# EAGLE design therm-coast (EAGLE 7.7.0)
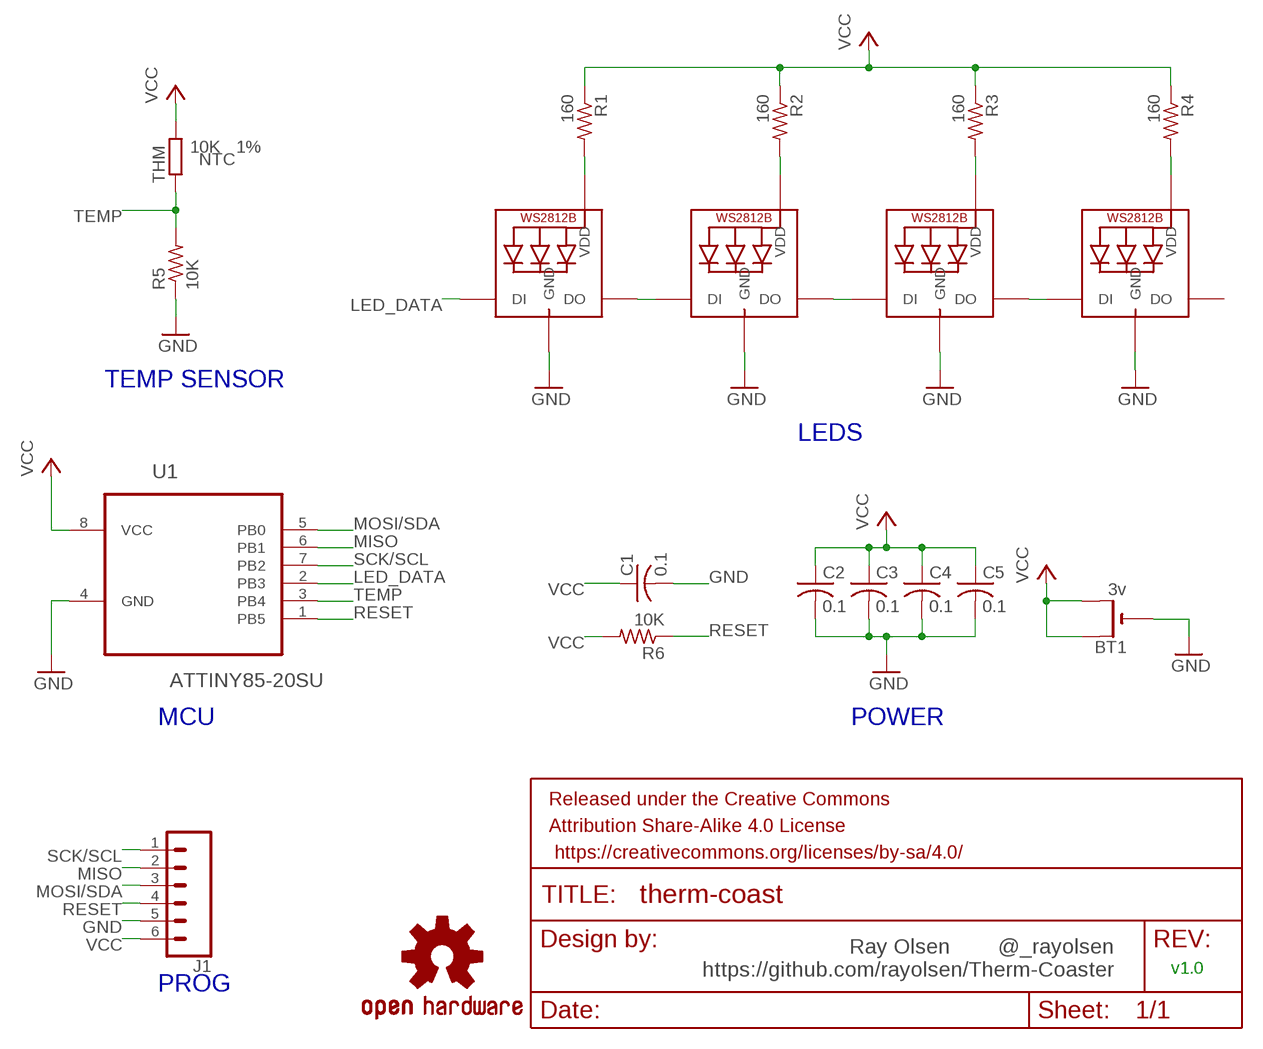
[diagram p0: schematic, sheet 1]

## Parts
BT1  3v  CR2032SMT  [CR2032-SMD]
C1  0.1  C-USC0805  [C0805]
C2  0.1  C-USC0805  [C0805]
C3  0.1  C-USC0805  [C0805]
C4  0.1  C-USC0805  [C0805]
C5  0.1  C-USC0805  [C0805]
FRAME1  FRAME-LETTER  [CREATIVE_COMMONS]
J1  CONN_06SMD-FEMALE-V2  [1X06-SMD-FEMALE]
LED1  WS2812B5050  [WS2812B]
LED2  WS2812B5050  [WS2812B]
LED3  WS2812B5050  [WS2812B]
LED4  WS2812B5050  [WS2812B]
LOGO1  OSHW-LOGOL  [OSHW-LOGO-L]
R1  160  R-US_R0805  [R0805]
R2  160  R-US_R0805  [R0805]
R3  160  R-US_R0805  [R0805]
R4  160  R-US_R0805  [R0805]
R5  10K  R-US_R0805  [R0805]
R6  10K  R-US_R0805  [R0805]
THM  10K  R-EU_R0805  [R0805]
U1  ATTINY85-20SU  [SOIC127P798X216-8N]

## Nets
GND: BT1.- C1.2 C2.2 C3.2 C4.2 C5.2 J1.5 LED1.3-GND(GND) LED2.3-GND(GND) LED3.3-GND(GND) LED4.3-GND(GND) R5.1 U1.4(GND)
LED_DATA: LED1.4-DIN(DI) U1.2(PB3)
MISO: J1.2 U1.6(PB1)
MOSI/SDA: J1.3 U1.5(PB0)
N$1: LED1.1-VDD(VDD) R1.2
N$2: LED2.1-VDD(VDD) R2.2
N$3: LED3.1-VDD(VDD) R3.2
N$4: LED4.1-VDD(VDD) R4.2
N$5: LED1.2-DOUT(DO) LED2.4-DIN(DI)
N$6: LED2.2-DOUT(DO) LED3.4-DIN(DI)
N$7: LED3.2-DOUT(DO) LED4.4-DIN(DI)
RESET: J1.4 R6.1 U1.1(PB5)
SCK/SCL: J1.1 U1.7(PB2)
TEMP: R5.2 THM.1 U1.3(PB4)
VCC: BT1.+$1(+) BT1.+$2(+1) C1.1 C2.1 C3.1 C4.1 C5.1 J1.6 R1.1 R2.1 R3.1 R4.1 R6.2 THM.2 U1.8(VCC)
Unconnected: LED4.2-DOUT(DO)

## Notes on the sheet
- TEMP SENSOR
- LEDS
- MCU | POWER
- Ray Olsen        @_rayolsen
  https://github.com/rayolsen/Therm-Coaster
- v1.0
- PROG

## Library data of the parts
BT1 = Adafruit:CR2032
C1-C5 = resistor:C-US: CAPACITOR, American symbol
FRAME1 = SparkFun-Aesthetics:FRAME-LETTER: Schematic Frame - Letter Standard 8.5x11 US Letter frame
J1 = SparkFun-Connectors:CONN_06: Multi connection point. Often used as Generic Header-pin footprint for 0.1 inch spaced/style header connections On any of the 0.1 inch spaced packages, you can populate with these: Break Away Headers - Straight <https://www.sparkfun.com/products/116> (PRT-00116) Break Away Male Headers - Right Angle <https://www.sparkfun.com/products/553> (PRT-00553) Female Headers <https://www.sparkfun.com/products/115> (PRT-00115) Break Away Headers - Machine Pin <https://www.sparkfun.com/products/117> (PRT-00117) Break Away Female Headers - Swiss Machine Pin <https://www.sparkfun.com/products/743> (PRT-00743) Arduino Stackable Header - 6 Pin <https://www.sparkfun.com/products/9280> (PRT-09280) For SCREWTERMINALS and SPRING TERMINALS visit here: Screw Terimnals on SparkFun.com <https://www.sparkfun.com/search/results?term=Screw+Terminals> (5mm/3.5mm/2.54mm spacing) This device is also useful as a general connection point to wire up your design to another part of your project. Our various solder wires solder well into these plated through hole pads. Hook-Up Wire - Assortment (Stranded, 22 AWG) <https://www.sparkfun.com/products/11375> (PRT-11375) Hook-Up Wire - Assortment (Solid Core, 22 AWG) <https://www.sparkfun.com/products/11367> (PRT-11367) View the entire wire category on our website here <https://www.sparkfun.com/categories/141>; PROD_ID: CONN-09668
LED1-LED4 = Adafruit:WS2812B
LOGO1 = SparkFun-Aesthetics:OSHW-LOGO: Open-Source Hardware (OSHW) Logo This logo indicates the piece of hardware it is found on incorporates a OSHW license and/or adheres to the definition of open source hardware found here: http://freedomdefined.org/OSHW
R1-R6 = resistor:R-US_: RESISTOR, American symbol
THM = resistor:R-EU_: RESISTOR, European symbol; TOLERANCE: 1%; TYPE: NTC
U1 = Atmel_By_element14_Batch_1-00:ATTINY85-20SU: 8-bit Microcontroller with In-System Programmable Flash; MPN: ATTINY85-20SU; OC_FARNELL: 1455164; OC_NEWARK: 58M3797; PACKAGE: SOIC-8; SUPPLIER: Atmel

## Net classes
0 default: width 0.813 mm

## Board
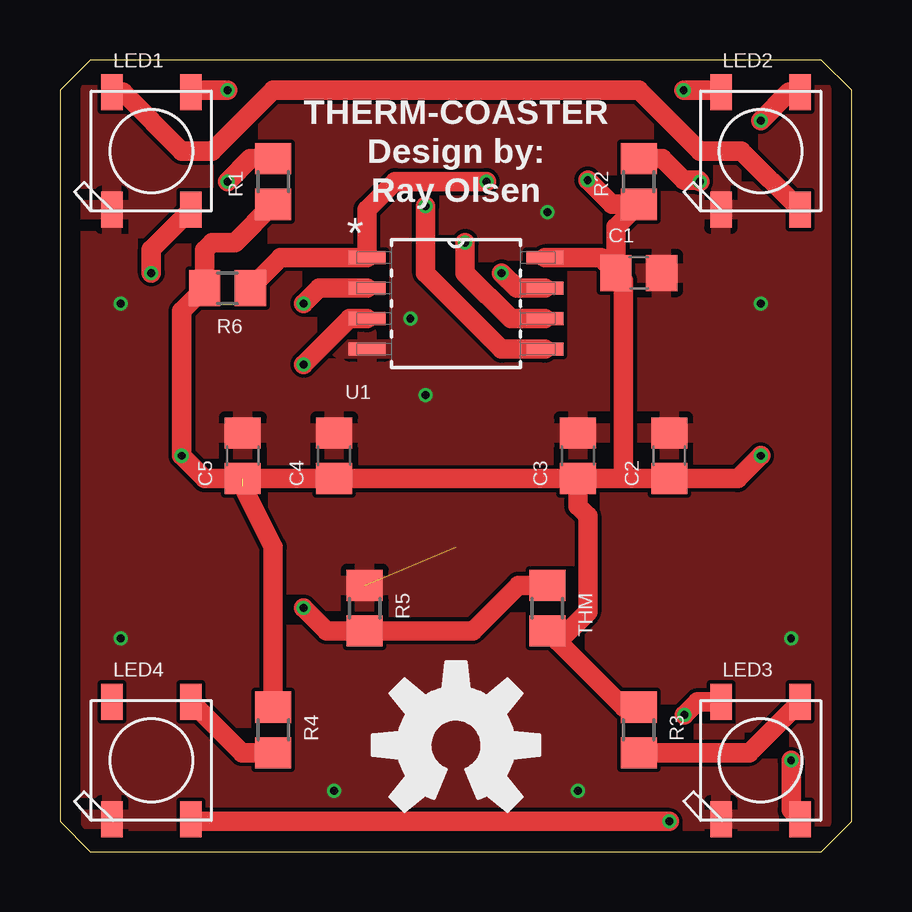
[diagram p1: board, top side]
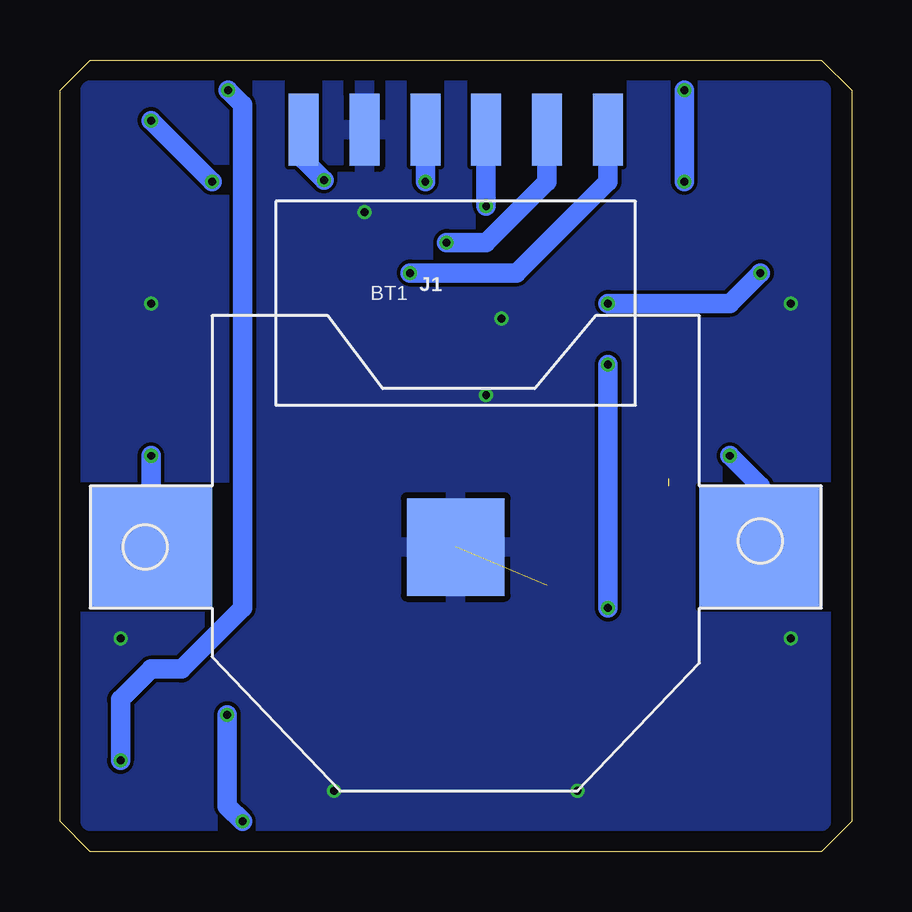
[diagram p2: board, bottom side, seen from below]

Size 33.01 x 33.01 mm. Coordinates in mm from the lower left corner, seen from the top.
Outline: 0,31.74 0,1.27 1.27,0 31.74,0 33.01,1.27 33.01,31.74 31.74,33.01 1.27,33.01 0,31.74
Copper layers (1*16): Top 0.035559375mm / dielectric 1.6mm / Bottom 0.035559375mm
Design rules "oshpark-2layer": minimum track width 6mil, minimum drill 10mil, track to track 6mil, track to pad 6mil, pad to pad 6mil, via to via 6mil, smd to smd 6mil, copper to edge 15mil, drill to drill 6mil, minimum pad ring 5mil, minimum via ring 5mil, stop-mask expansion 2.5mil, vias tented up to drill 0mil, thermal gap 10mil

### Footprints (pad centres in the part's own frame; a part is rotated, then mirrored left to right if it is on the bottom)
CR2032-SMD = smd 5.08 x 5.08: +$1 -12.7,0; +$2 12.7,0 | smd 4.064 x 4.064: - 0,0
C0805 = smd 1.3 x 1.5: 1 -0.95,0; 2 0.95,0
1X06-SMD-FEMALE = smd 1.25 x 3: 1 6.35,3.425; 2 3.81,3.425; 3 1.27,3.425; 4 -1.27,3.425; 5 -3.81,3.425; 6 -6.35,3.425
WS2812B = smd 1.5 x 0.9: 1-VDD 2.45,-1.65; 2-DOUT 2.45,1.65; 3-GND -2.45,1.65; 4-DIN -2.45,-1.65
R0805 = smd 1.3 x 1.5: 1 -0.95,0; 2 0.95,0
SOIC127P798X216-8N = smd 1.549 x 0.533: 1 -3.708,1.905; 2 -3.708,0.635; 3 -3.708,-0.635; 4 -3.708,-1.905; 5 3.708,-1.905; 6 3.708,-0.635; 7 3.708,0.635; 8 3.708,1.905

### Placement (x,y rotation side)
BT1  16.51,12.7 0 bottom
C1  24.13,24.13 0 top
C2  25.4,16.51 90 top
C3  21.59,16.51 90 top
C4  11.43,16.51 90 top
C5  7.62,16.51 90 top
J1  16.51,26.67 0 bottom
LED1  3.81,29.21 90 top
LED2  29.21,29.21 90 top
LED3  29.21,3.81 90 top
LED4  3.81,3.81 90 top
LOGO1  16.51,4.45 0 top
R1  8.89,27.94 90 top
R2  24.13,27.94 90 top
R3  24.13,5.08 270 top
R4  8.89,5.08 270 top
R5  12.7,10.16 270 top
R6  6.99,23.5 180 top
THM  20.32,10.16 270 top
U1  16.51,22.86 0 top

### Tracks (layer width: path | path; a pad name or v marks a point on that pad's centre or on a via)
GND  (via drill 0.33)  (1 unrouted)
  other vias: 15.24,19.05 14.61,22.23 29.21,22.86 2.54,22.86 2.54,8.89 30.48,8.89 21.59,2.54 11.43,2.54 20.32,26.67
  pour Top: 1.27,31.75 31.75,31.75 31.75,1.27 1.27,1.27
  pour Bottom: 1.27,31.75 31.75,31.75 31.75,1.27 1.27,1.27
LED_DATA  (via drill 0.33)
  Top 0.813: U1.2 10.79,23.5 v10.16,22.86 | v3.81,24.13 3.81,25.11 LED1.4-DIN
  Bottom 0.813: v10.16,22.86 5.08,22.86 v3.81,24.13
MISO  (via drill 0.33)
  Top 0.813: U1.6 18.8,22.23 16.89,24.13 v16.89,25.4
  Bottom 0.813: v16.89,25.4 15.24,25.4 12.7,27.94 J1.2
MOSI/SDA  (via drill 0.33)
  Top 0.813: U1.5 18.41,20.95 15.24,24.13 v15.24,26.92
  Bottom 0.813: v15.24,26.92 J1.3
N$1  (via drill 0.33)
  Top 0.813: 8.57,28.89 R1.2 7.93,28.89 v6.99,27.94 | v6.99,31.75 5.55,31.75 LED1.1-VDD
  Bottom 0.813: v6.99,27.94 v6.99,31.75
N$2  (via drill 0.33)
  Top 0.813: LED2.1-VDD 30.39,31.66 v29.21,30.48 | R2.2 25.11,28.89 26,28 26.61,28 v26.67,27.94
  Bottom 0.813: v29.21,30.48 v26.67,27.94
N$3
  Top 0.813: R3.2 28.73,4.13 LED3.1-VDD
N$4
  Top 0.813: R4.2 7.59,4.13 LED4.1-VDD
N$5
  Top 0.813: LED1.2-DOUT 2.63,31.66 5.08,29.21 6.35,29.21 8.89,31.75 24.13,31.75 26.67,29.21 28.41,29.21 LED2.4-DIN
N$6  (via drill 0.33)
  Top 0.813: v30.48,3.81 30.48,1.74 LED3.4-DIN | v26,31.75 27.47,31.75 LED2.2-DOUT
  Bottom 0.813: v30.48,3.81 30.48,6.35 29.21,7.62 27.94,7.62 25.4,10.16 25.4,31.15 v26,31.75
N$7  (via drill 0.33)
  Top 0.813: LED3.2-DOUT 26.58,6.26 v26.04,5.71 | v25.4,1.27 5.55,1.27 LED4.4-DIN
  Bottom 0.813: v26.04,5.71 26.04,1.91 v25.4,1.27
RESET  (via drill 0.33)
  Top 0.813: v17.78,27.94 13.97,27.94 12.8,26.77 U1.1 9.21,24.77 R6.1
  Bottom 0.813: v17.78,27.94 J1.4
SCK/SCL  (via drill 0.33)
  Top 0.813: U1.7 19.05,23.5 v18.41,24.13
  Bottom 0.813: v18.41,24.13 13.97,24.13 10.16,27.94 J1.1
TEMP  (via drill 0.33)
  Top 0.813: v10.16,10.16 11.11,9.21 R5.2 17.21,9.21 19.11,11.11 THM.1 | U1.3 12.06,22.23 v10.16,20.32
  Bottom 0.813: v10.16,20.32 v10.16,10.16
VCC  (via drill 0.33)  (1 unrouted)
  Top 0.813: C1.1 23.18,26.04 R2.1 23,27 v22,28 | THM.2 20.77,8.77 | 20.77,8.77 23.5,6.03 R3.1 | C3.1 23.5,15.56 | 23.5,15.56 C2.1 28.26,15.56 v29.21,16.51 | C5.1 C4.1 C3.1 | R4.1 8.89,12.7 7.62,15.24 | 23.5,15.56 23.5,23.82 C1.1 | C1.1 22.55,24.77 U1.8 | 7.3,15.56 C5.1 | R1.1 7.3,25.4 6.35,25.4 6.04,25.09 R6.2 5.08,22.54 v5.08,16.51 6.03,15.56 C5.1 | C3.1 21.59,14.41 22,14 22,10 20.77,8.77
  Bottom 0.813: 3.81,13.97 BT1.+$2 3.81,15.24 v5.08,16.51 | BT1.+$1 v29.21,16.51 | v22,28 22.86,28.86 J1.6

### Text on the board
tPlace: THERM-COASTER / Design by: / Ray Olsen